# Altium schematic sheet SAMR21_Xplained_Pro_Crystals.SchDoc: Target Peripherals
size A3; Organization: ATMEL Norway; Address1: Vestre Rosten 79; Address2: N-7075 TILLER; Address3: NORWAY; DocumentNumber: A09-2127; Revision: 3; SheetNumber: 3; SheetTotal: 7; PageSetup: Record=PageOptions|CenterHorizontal=True|CenterVertical=True|PrintScale=1.01|XCorrection=1.00|YCorrection=1.00|PrintKind=1|BorderSize=5000000|LeftOffset=0|BottomOffset=0|Orientation=2|PaperLength=1000|PaperWidth=1000|Scale=100|PaperSource=7|PrintQuality=-4|MediaType=1|DitherType=10|PaperKind=A3 (297 x 420 mm)|PrintScaleMode=1
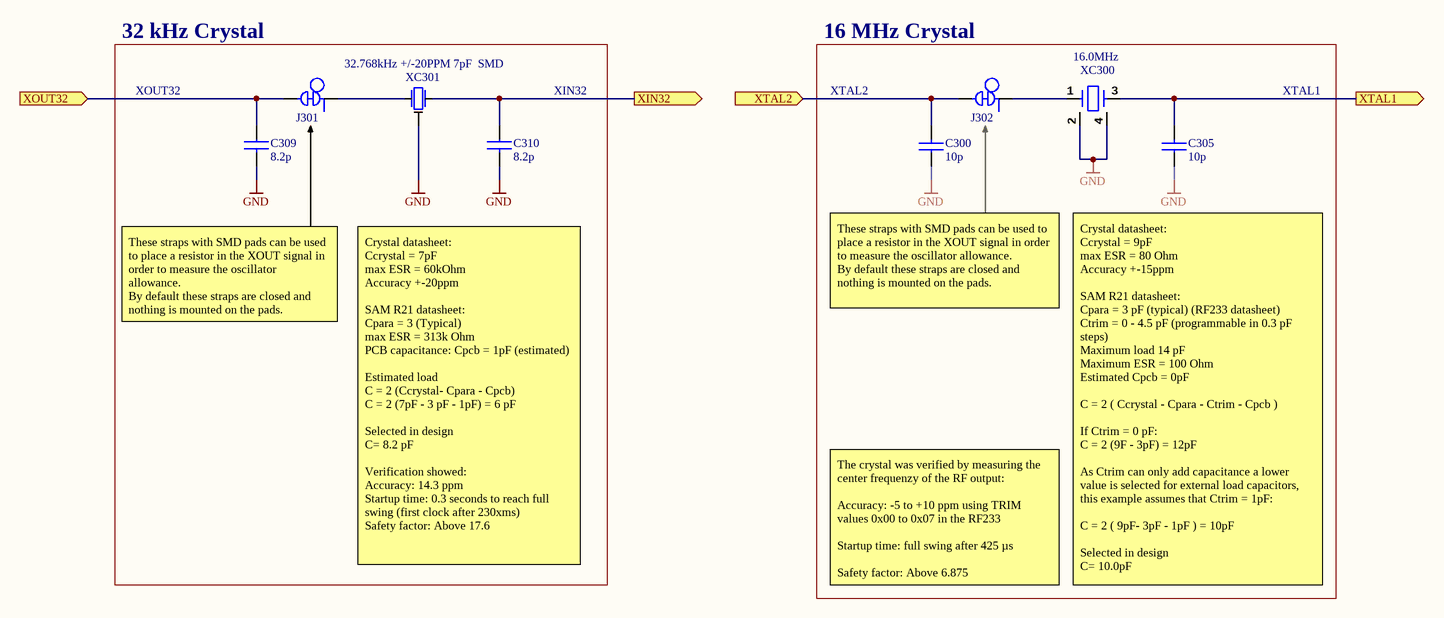
[diagram p0: SAMR21_Xplained_Pro_Crystals.SchDoc]

## Parts
C300  value 10p  [AP1-00001]  (hidden comment: CAP-NONPOL)
C305  value 10p  [AP1-00001]  (hidden comment: CAP-NONPOL)
C309  value 8.2p  [AP1-00001]  (hidden comment: CAP-NONPOL)
C310  value 8.2p  [AP1-00001]  (hidden comment: CAP-NONPOL)
J301  SMD-STRAP_CLOSED  [AP8-00595]  (value not drawn)  (net tie, no BOM)
J302  SMD-STRAP_CLOSED  [AP8-00595]  (value not drawn)  (net tie, no BOM)
XC300  value 16.0MHz  [AP7-00061]  (hidden comment: TSX-3225)
XC301  value 32.768kHz +/-20PPM 7pF  SMD  [AP7-00044]  (hidden comment: Farnell order no:1539364)

## Blocks framed on the sheet
32 kHz Crystal: C309 C310 J301 XC301
16 MHz Crystal: C300 C305 J302 XC300

## Ports
XIN32 (out), XOUT32 (in), XTAL1 (out), XTAL2 (in)

## Nets
GND: C300.1 C305.1 C309.2 C310.2 XC300.2(GND) XC300.4(GND) XC301.3
XIN32: C310.1 XC301.2 ; port XIN32
XOUT32: C309.1 J301.2 ; port XOUT32
XTAL1: C305.2 XC300.3(OUT) ; port XTAL1
XTAL2: C300.2 J302.2 ; port XTAL2
NetJ301_1: J301.1 XC301.1
NetJ302_1: J302.1 XC300.1(IN)

## Notes on the sheet
- XOUT32
- XIN32
- XTAL2
- XTAL1
- These straps with SMD pads can be used to place a resistor in the XOUT signal in order to measure the oscillator allowance.
  By default these straps are closed and nothing is mounted on the pads.
- Crystal datasheet:
  Ccrystal = 7pF
  max ESR = 60kOhm
  Accuracy +-20ppm
  SAM R21 datasheet:
  Cpara = 3 (Typical)
  max ESR = 313k Ohm
  PCB capacitance: Cpcb = 1pF (estimated)
  Estimated load
  C = 2 (Ccrystal- Cpara - Cpcb)
  C = 2 (7pF - 3 pF - 1pF) = 6 pF
  Selected in design
  C= 8.2 pF
  Verification showed:
  Accuracy: 14.3 ppm
  Startup time: 0.3 seconds to reach full swing (first clock after 230xms)
  Safety factor: Above 17.6
- The crystal was verified by measuring the center frequenzy of the RF output:
  Accuracy: -5 to +10 ppm using TRIM values 0x00 to 0x07 in the RF233
  Startup time: full swing after 425 µs
  Safety factor: Above 6.875
- Crystal datasheet:
  Ccrystal = 9pF
  max ESR = 80 Ohm
  Accuracy +-15ppm
  SAM R21 datasheet:
  Cpara = 3 pF (typical) (RF233 datasheet)
  Ctrim = 0 - 4.5 pF (programmable in 0.3 pF steps)
  Maximum load 14 pF
  Maximum ESR = 100 Ohm
  Estimated Cpcb = 0pF
  C = 2 ( Ccrystal - Cpara - Ctrim - Cpcb )
  If Ctrim = 0 pF:
  C = 2 (9F - 3pF) = 12pF
  As Ctrim can only add capacitance a lower value is selected for external load capacitors, this example assumes that Ctrim = 1pF:
  C = 2 ( 9pF- 3pF - 1pF ) = 10pF
  Selected in design
  C= 10.0pF
- Date:
- PAGE:
- of
- TITLE:
- Document number:
- Revision:

## Library data of the parts
C300 C305 = A01-0015: Ceramic capacitor, SMD 0402, NP0, 50V, +/-5%; PartGroup: Capacitors,Ceramic,SMD 0402; TemperatureRange: -55 - +125 deg C; AN: A01-0015; Tolerance: 50V, +/-5%; Height: 0,550000011920929
C309 C310 = A01-0014: Ceramic capacitor, SMD 0402, NP0, 50V, +/-5%; PartGroup: Capacitors,Ceramic,SMD 0402; TemperatureRange: -55 - +125 deg C; AN: A01-0014; Tolerance: 50V, +/-5%; Height: 0.550000011920929
J301 J302 = A08-1454: Closed Link 0402; PartGroup: Mechanical devices,PCB implemented components; AN: A08-1454; Value: Closed Link
XC300 = A07-0078: 16MHz uXtal, 3.2 x 2.5 mm SMD, CL=9pF, 15PPM, ESR=80ohm(Max.; PartGroup: Frequency devices,Crystals,SMD; Manufacturer: Epson Toyocom; MPN: TSX-3225 16.0000MF09Z-AC3; TemperatureRange: -40°C to +85°C; AN: A07-0078; Tolerance: 15ppm; Height: 0,699999988079071
XC301 = A07-0052: 32k768 crystal, +-20ppm, CL=7pF, max ESR 60kOhm, SMD; PartGroup: Frequency devices,Crystals,SMD; Manufacturer: Micro Crystal; MPN: MS1V-T1K 32.768kHz 7pF +/-20PPM TA; Tolerance: +/- 20 PPM; TemperatureRange: -40 /+85; AN: A07-0052; Height: 2,07999992370605